# EAGLE schematic interfacciaAtMega2560 (EAGLE 6.5.0)
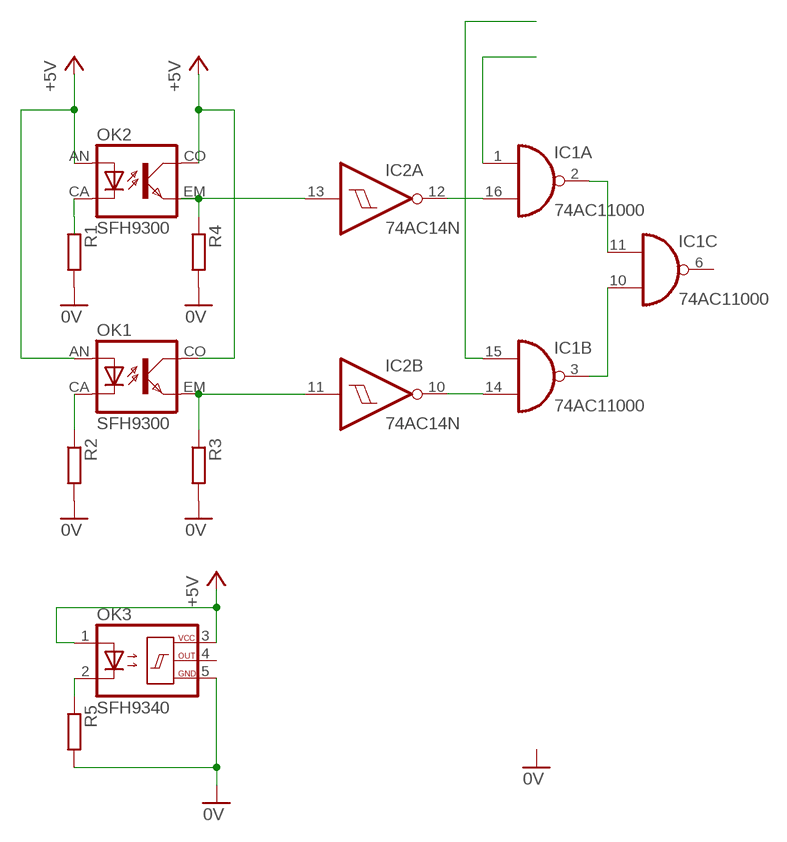
[diagram p0: schematic, sheet 1]

## Parts
IC1  74AC11000  [DIL16]
IC2  74AC14N  [DIL14]
OK1  SFH9300  [SFH9300]
OK2  SFH9300  [SFH9300]
OK3  SFH9340  [SFH9340]
R1  R-EU_0411/12  [0411/12]
R2  R-EU_0411/12  [0411/12]
R3  R-EU_0411/12  [0411/12]
R4  R-EU_0411/12  [0411/12]
R5  R-EU_0411/12  [0411/12]

## Nets
0V: OK3.5(GND) R1.2 R2.2 R3.2 R4.2 R5.2
+5V: OK1.AN(A) OK1.CO(COL) OK2.AN(A) OK2.CO(COL) OK3.1(A) OK3.3(VCC)
N$1: OK2.CA(C) R1.1
N$2: IC2.13(A:I) OK2.EM(EMIT) R4.1
N$3: IC2.11(B:I) OK1.EM(EMIT) R3.1
N$4: OK1.CA(C) R2.1
N$6: IC1.16(A:I1) IC2.12(A:O)
N$7: IC1.14(B:I1) IC2.10(B:O)
N$8: IC1.2(A:O) IC1.11(C:I0)
N$9: IC1.3(B:O) IC1.10(C:I1)
N$10: IC1.1(A:I0)
N$11: IC1.15(B:I0)
N$13: OK3.2(C) R5.1
Unconnected: IC1.6(C:O) IC1.7(D:O) IC1.8(D:I1) IC1.9(D:I0) IC2.1(D:I) IC2.2(D:O) IC2.3(E:I) IC2.4(E:O) IC2.5(F:I) IC2.6(F:O) IC2.8(C:O) IC2.9(C:I) OK3.4(OUT)

## Power pins joined to a net without a drawn wire
GND: IC1.4(P:GND) IC1.5(P:GND) IC2.7(P:GND)
VCC: IC1.12(P:VCC) IC1.13(P:VCC) IC2.14(P:VCC)

## Library data of the parts
IC1 = 74ac-logic:74AC11000: Quadruple 2-input NAND
IC2 = 74xx-eu:74*14: Hex schmitt trigger INVERTER
OK1 OK2 = optocoupler:SFH9*: Slotted Interrupter / Gabellichtschranke Source: http://www.osram.convergy.de/; OC_FARNELL: unknown; OC_NEWARK: unknown
OK3 = optocoupler:SFH934*: Slotted Interrupter with Schmitt-Trigger-IC Gabellichtschranke mit Schmitt-Trigger IC Source: http://www.osram.convergy.de/ ... sfh9340.pdf; OC_FARNELL: unknown; OC_NEWARK: unknown
R1-R5 = rcl:R-EU_: RESISTOR, European symbol